# Altium schematic sheet Processor.SchDoc
size A4; SheetNumber: 2; SheetTotal: 5; SPICEModelCacheYJUROCZO: <root> / <DocumentId>YJUROCZO</DocumentId> / <CacheFrame Number="0"> / <Model Name="umk107bj105_a-t" Kind="CKT"> / <Text>* UMK107BJ105_A-T     SPICE MODEL  ( General Type ) / *-------------------------------------------------------------------------------------------------------- / * Model Generated by TAIYO YUDEN Corporation (http://www.ty-top.com) / * Version 1.0 / * TAIYO YUDEN Control No. 170508_130520 / * Copyright(c) 2012 TAIYO YUDEN CO.,LTD. All Rights Reserved. / *-------------------------------------------------------------------------------------------------------- / * / * Products Name : Multilayer Ceramic Capacitors / * / * Characteristics : / *     Capacitance : 1 uF , Rated Voltage : 50V , TCC : X5R / *     Case Size : 1.6 x 0.8 / 0.063 x 0.031 [mm/inch] , Thickness : 0.8 / 0.031 [mm/inch] / *     (Conditions: Temperature = 25 degC , DC Bias Current/Voltage = 0A / 0V) / * / * Frequency Range : 40Hz - 3GHz / * / * External Node Assignments : / * / *  1  o---| |---o  2 / * / *-------------------------------------------------------------------------------------------------------- / .SubCkt UMK107BJ105_A-T 1 2 / **************************** / C0 1 110 0.79929u / Cm 1 101 0.13681u / C1 101 102 0.26224u / Rc1 101 102 5.8806k / C2 102 103 0.057839u / Rc2 102 103 469.42 / C3 103 110 0.014568u / Rc3 103 110 14.853 / C2m 1 301 0.13283u / C21 301 302 1.2593u / Rc21 301 302 6.3079k / C22 302 303 1.1189u / Rc22 302 303 6.9405k / C23 303 304 1.1421u / Rc23 303 304 6.4848k / C24 304 305 0.36861u / Rc24 304 305 785 / C25 305 306 0.39327u / Rc25 305 306 637.41 / C26 306 307 0.27451u / Rc26 306 307 19.365 / C27 307 308 0.15295u / Rc27 307 308 23.239 / C28 308 309 0.17569u / Rc28 308 309 17.788 / C29 309 110 1420.6p / Rc29 309 110 1.9725 / Rp0 1 110 500Meg / L0 110 120 0.24088n / Lm 120 130 0.1369n / L1 120 121 0.1842n / RL1 121 130 0.29804 / L2 120 122 0.40657n / RL2 122 130 0.57395 / L3 120 123 0.85773n / RL3 123 130 0.82282 / CR 120 124 0.11463u / LR 124 125 0.25983n / RR 125 130 52.447m / CL 130 140 1.4637p / LL 130 140 0.23986n / RL 130 140 33.985 / Rs 140 2 6.8539m / **************************** / .ends UMK107BJ105_A-T</Text> / </Model> / </CacheFrame> / </root>
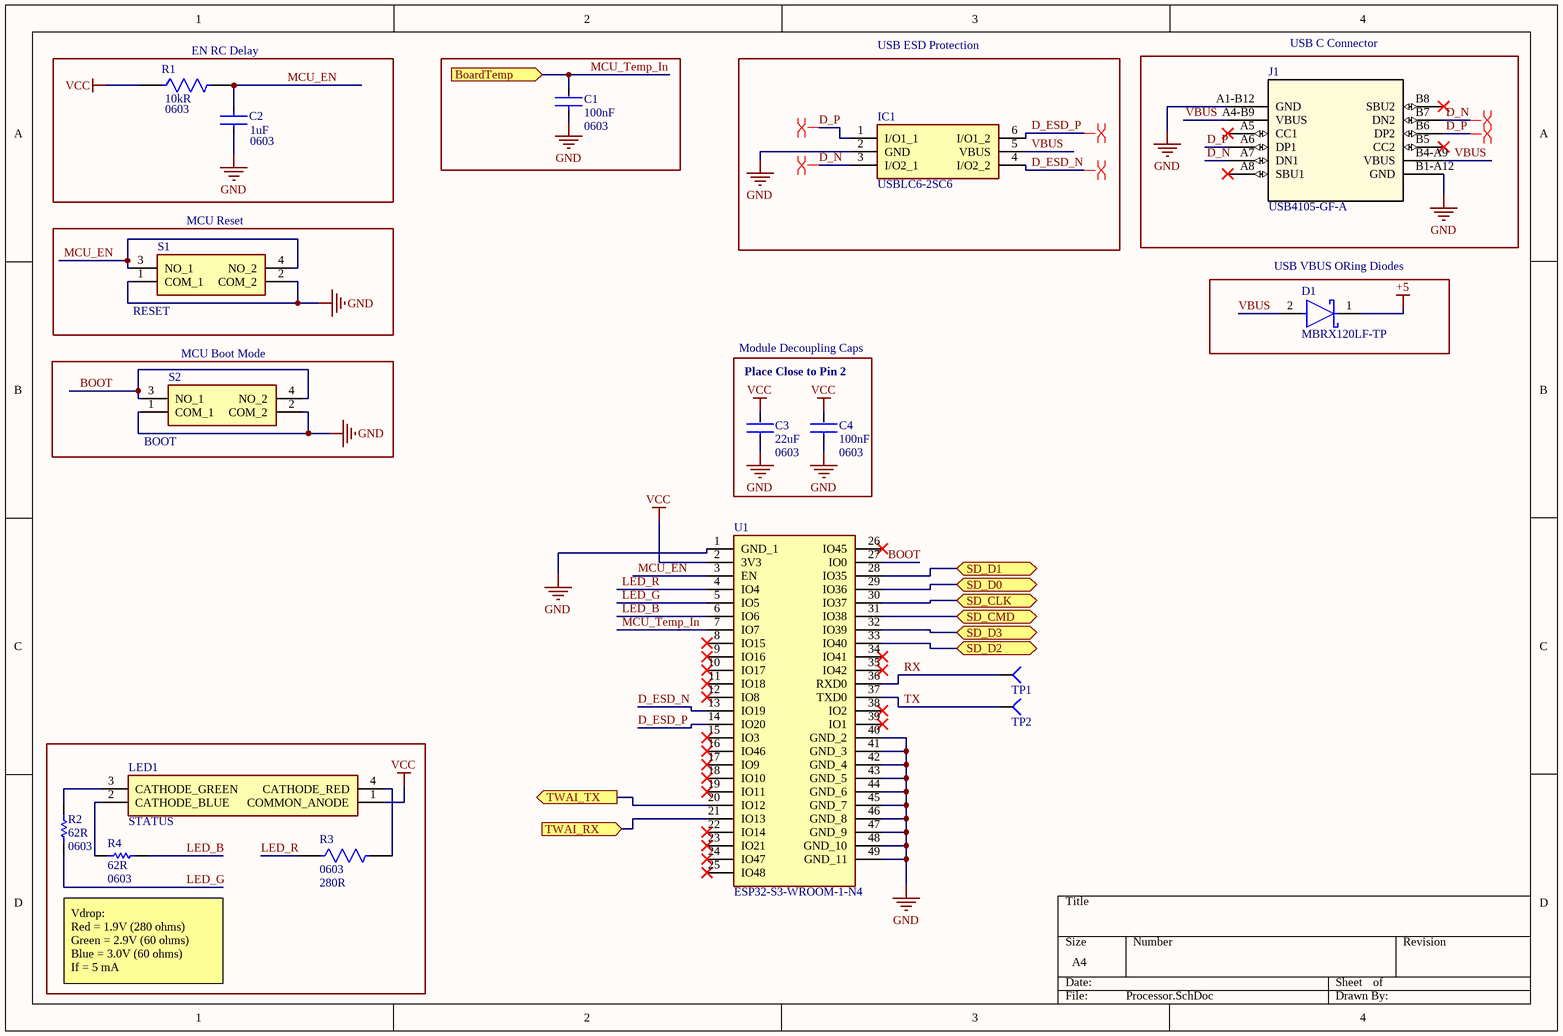
[diagram p0: Processor.SchDoc]

## Parts
C1  Capacitance: 100nF  Case/Package: 0603  [FP-CL10-IPC_A]  (hidden comment: CL10B104KB8WPNC)
C2  Case/Package: 0603  Capacitance: 1uF  [FP-0603-L_1_6_0_1-W_0_8_0-IPC_A]  (hidden comment: UMK107BJ105KA-T)
C3  Capacitance: 22uF  Case Code (Imperial): 0603  [FP-GRM188-0_2-IPC_C]  (hidden comment: GRM188R61A226ME15D)
C4  Capacitance: 100nF  Case/Package: 0603  [FP-CL10-IPC_A]  (hidden comment: CL10B104KB8WPNC)
D1  MBRX120LF-TP  [FP-SOD-123-IPC_A]
IC1  USBLC6-2SC6  [SOT95P280X145-6N]
J1  USB4105-GF-A  [USB4105_GCT]
LED1  STATUS  [CLMVCFKACL1D1L71BB7C3C3]
R1  Case Code (Imperial): 0603  Resistance: 10kR  [FP-RMCF0603-MFG]  (hidden comment: RMCF0603JG10K0)
R2  Resistance: 62R  Package: 0603  [RESC1608X55X30ML15T15]  (hidden comment: ERJ-3GEYJ620V)
R3  Case/Package: 0603  Resistance: 280R  [FP-RMCF0603-MFG]  (hidden comment: RMCF0603FT280R)
R4  Resistance: 62R  Package: 0603  [RESC1608X55X30ML15T15]  (hidden comment: ERJ-3GEYJ620V)
S1  RESET  [PTS526SKG15SMTR2LFS]
S2  BOOT  [PTS526SKG15SMTR2LFS]
TP1  RX  [TESTPOINT_CIRCLE_1MM]  (value not drawn)  (no BOM)
TP2  TX  [TESTPOINT_CIRCLE_1MM]  (value not drawn)  (no BOM)
U1  ESP32-S3-WROOM-1-N4  [ESP32S3WROOM1N4]

## Blocks framed on the sheet
EN RC Delay: C2 R1
USB ESD Protection: IC1
USB C Connector: J1
MCU Reset: S1
USB VBUS ORing Diodes: D1
MCU Boot Mode: S2

## Ports
BoardTemp (in), SD_CLK (bidir), SD_CMD (bidir), SD_D0 (bidir), SD_D1 (bidir), SD_D2 (bidir), SD_D3 (bidir), TWAI_RX (in), TWAI_TX (out)

## Nets
+5: D1.1(C)
GND: C1.1 C2.2 C3.1 C4.1 IC1.2(GND) J1.A1-B12(GND) J1.B1-A12(GND) S1.1(COM_1) S1.2(COM_2) S2.1(COM_1) S2.2(COM_2) U1.1(GND_1) U1.40(GND_2) U1.41(GND_3) U1.42(GND_4) U1.43(GND_5) U1.44(GND_6) U1.45(GND_7) U1.46(GND_8) U1.47(GND_9) U1.48(GND_10) U1.49(GND_11)
VCC: C3.2 C4.2 LED1.1(COMMON_ANODE) R1.1 U1.2(3V3)
BOOT: S2.3(NO_1) S2.4(NO_2) U1.27(IO0)
D_ESD_N: IC1.4(I/O2_2) U1.13(IO19)
D_ESD_P: IC1.6(I/O1_2) U1.14(IO20)
D_N: IC1.3(I/O2_1) J1.A7(DN1) J1.B7(DN2)
D_P: IC1.1(I/O1_1) J1.A6(DP1) J1.B6(DP2)
LED_B: R4.2 U1.6(IO6)
LED_G: R2.2 U1.5(IO5)
LED_R: R3.1 U1.4(IO4)
MCU_EN: C2.1 R1.2 S1.3(NO_1) S1.4(NO_2) U1.3(EN)
MCU_Temp_In: C1.2 U1.7(IO7) ; port BoardTemp
RX: TP1.1(=value) U1.36(RXD0)
SD_CLK: U1.30(IO37) ; port SD_CLK
SD_CMD: U1.31(IO38) ; port SD_CMD
SD_D0: U1.29(IO36) ; port SD_D0
SD_D1: U1.28(IO35) ; port SD_D1
SD_D2: U1.33(IO40) ; port SD_D2
SD_D3: U1.32(IO39) ; port SD_D3
TWAI_RX: U1.21(IO13) ; port TWAI_RX
TWAI_TX: U1.20(IO12) ; port TWAI_TX
TX: TP2.1(=value) U1.37(TXD0)
VBUS: D1.2(A) IC1.5(VBUS) J1.A4-B9(VBUS) J1.B4-A9(VBUS)
NetLED1_2: LED1.2(CATHODE_BLUE) R4.1
NetLED1_3: LED1.3(CATHODE_GREEN) R2.1
NetLED1_4: LED1.4(CATHODE_RED) R3.2

Not connected (* = marked no-connect by the designer): J1 A5(CC1)* A8(SBU1)* B5(CC2)* B8(SBU2)*; U1 8(IO15)* 9(IO16)* 10(IO17)* 11(IO18)* 12(IO8)* 15(IO3)* 16(IO46)* 17(IO9)* 18(IO10)* 19(IO11)* 22(IO14)* 23(IO21)* 24(IO47)* 25(IO48)* 26(IO45)* 34(IO41)* 35(IO42)* 38(IO2)* 39(IO1)*

## Layout directives
differential pair: D_ESD_N, D_ESD_P, D_N, D_P

## Notes on the sheet
- Module Decoupling Caps
- Place Close to Pin 2
- Vdrop:
  Red = 1.9V (280 ohms)
  Green = 2.9V (60 ohms)
  Blue = 3.0V (60 ohms)
  If = 5 mA

## Library data of the parts
C1 C4 = CMP-13271-002353-1: Cap Ceramic 100nF 50V X7R ±10% Pad SMD 0603 +125°C T/R; Ratings: AEC-Q200; Features: Soft Termination; Max Operating Temperature: 125°C; Mount: Surface Mount; Width: 0.031inch; Voltage Rating: 50V; Case Code (Metric): 1608; Case Code (Imperial): 0603; Tolerance: 10%; Min Operating Temperature: -55°C; Thickness: 0.035inch; Lead Free: Lead Free; Packaging: Tape and Reel; Length: 0.063inch
C2 = CMP-2000-05447-3: None; Tolerance: 10%; Voltage Rating: 50V; Dielectric: X5R; Height: 0.8mm; Depth: 0.8mm; Number of Pins: 2; Length: 1.6mm; Thickness: 0.035inch; Contact Plating: Nickel; Radiation Hardening: No; Package Quantity: 1; Halogen Free: Halogen Free; RoHS Compliant: Yes; Termination: SMD/SMT; Max Operating Temperature: 85°C; Min Operating Temperature: -55°C; Case Code (Metric): 1608; Construction: Flat; Voltage Rating (DC): 50V; Packaging: Tape and Reel; Series: M; Case Code (Imperial): 0603; Width: 0.031inch; Mount: Surface Mount
C3 = CMP-2000-06337-3: Chip Multilayer Ceramic Capacitors for General Purpose, 0603, 22uF, X5R, 15%, 20%, 10V; Tolerance: 20%; Weight: 0.000222oz; Material: Ceramic; Depth: 0.8mm; Length: 1.6mm; Termination: SMD/SMT; Packaging: Tape and Reel; Width: 0.8mm; Voltage Rating: 10V; Mount: Surface Mount; Voltage Rating (DC): 10V; Case/Package: 0603; Thickness: 0.039inch; REACH SVHC: No SVHC; Dielectric: X5R; Height: 0.8mm; Package Quantity: 4000; Case Code (Metric): 1608; Min Operating Temperature: -55°C; Lead Free: Lead Free; Max Operating Temperature: 85°C
D1 = CMP-56206-000012-1: DIODE SCHOTTKY 20V 1A SOD123; Max Power Dissipation: 556mW; Forward Voltage: 360mV; Peak Non-Repetitive Surge Current: 12A; Element Configuration: Single; Max Reverse Voltage (DC): 20V; Lead Free: Lead Free; Max Operating Temperature: 125°C; Radiation Hardening: No; Mount: Surface Mount; Number of Pins: 2; Average Rectified Current: 1A; Min Operating Temperature: -65°C; Max Repetitive Reverse Voltage (Vrrm): 20V; RoHS Compliant: Yes; Package Quantity: 1; Max Forward Surge Current (Ifsm): 12A; Packaging: Tape and Reel; Max Surge Current: 12A; Forward Current: 1A
IC1 = USBLC6-2SC6: Integrated Circuit; Manufacturer_Name: STMicroelectronics; Datasheet Link: http://www.st.com/st-web-ui/static/active/en/resource/technical/document/datasheet/CD00050750.pdf; Height: 1.45mm; Manufacturer_Part_Number: USBLC6-2SC6; Mouser Part Number: 511-USBLC6-2SC6; Mouser Price/Stock: https://www.mouser.co.uk/ProductDetail/STMicroelectronics/USBLC6-2SC6?qs=po45yt2pPpu%2FhNIlwQdTlg%3D%3D; Arrow Part Number: USBLC6-2SC6; Arrow Price/Stock: https://www.arrow.com/en/products/usblc6-2sc6/stmicroelectronics?region=nac
J1 = USB4105-GF-A: No Description Available; Mfr_Name: Global Connector Technology; Copyright: Copyright (C) 2022 Ultra Librarian. All rights reserved.; Manufacturer_Part_Number: USB4105-GF-A; Digi-Key_Part_Number_1: 2073-USB4105-GF-ACT-ND; Digi-Key_Part_Number_2: 2073-USB4105-GF-ADKR-ND; Digi-Key_Part_Number_3: 2073-USB4105-GF-ATR-ND; RefDes: RefDes; Type: DEV
LED1 = CLMVC-FKA-CL1D1L71BB7C3C3: LED; Manufacturer_Name: Wolfspeed; Datasheet Link: https://www.cree.com/led-components/media/documents/1273-CLMVC-FKA.pdf; Height: 1mm; Manufacturer_Part_Number: CLMVC-FKA-CL1D1L71BB7C3C3; Mouser Part Number: 941-CLMVCFKACL1D1L71; Mouser Price/Stock: https://www.mouser.co.uk/ProductDetail/Cree-LED/CLMVC-FKA-CL1D1L71BB7C3C3?qs=fSnNYG2PaKLJAXXrLOgMiQ%3D%3D; Arrow Part Number: CLMVC-FKA-CL1D1L71BB7C3C3; Arrow Price/Stock: https://www.arrow.com/en/products/clmvc-fka-cl1d1l71bb7c3c3/cree-led?region=nac
R1 = CMP-26527-000153-1: 10kΩ ±5% 0.1W 0603 Thick Film Chip Resistor AEC-Q200 compliant; Temperature Coefficient: 200ppm/°C; Max Power Dissipation: 100mW; Tolerance: 5%; Series: RMCF; Resistor Type: Thick Film; Length: 0.061inch; Features: Automotive AEC-Q200; Height: 0.022inch; Case Code (Metric): 1608; Width: 0.031inch; Number of Terminations: 2; Contact Plating: Tin; Case/Package: 0603; Package Quantity: 1; Max Operating Temperature: 155°C; Mount: Surface Mount; RoHS Compliant: Yes; Radiation Hardening: No; Min Operating Temperature: -55°C; Packaging: Tape and Reel
R2 R4 = CMP-1012-00045-2: Manufacturer: Panasonic; Part Number: ERJ-3GEYJ620V
R3 = CMP-26527-006784-1: 280Ω ±1% 0.1W 0603 Thick Film Chip Resistor AEC-Q200 compliant; Max Power Dissipation: 100mW; Temperature Coefficient: 100ppm/°C; RoHS Compliant: Yes; Height: 0.022inch; Resistor Type: Thick Film; Case Code (Metric): 1608; Radiation Hardening: No; Contact Plating: Tin; Series: RMCF; Features: Automotive AEC-Q200; Number of Terminations: 2; Tolerance: 1%; Packaging: Tape and Reel; Max Operating Temperature: 155°C; Min Operating Temperature: -55°C; Length: 0.061inch; Lead Free: Lead Free; Width: 0.031inch; Mount: Surface Mount; Case Code (Imperial): 0603
S1 S2 = PTS526_SK08_SMTR2_LFS: Switch; Manufacturer_Name: C & K COMPONENTS; Manufacturer_Part_Number: PTS526 SK08 SMTR2 LFS; Datasheet Link: https://www.ckswitches.com/media/2780/pts526.pdf; Height: 1.6mm; Mouser Part Number: 611-PTS526SK08SMTR2L; Mouser Price/Stock: https://www.mouser.co.uk/ProductDetail/CK/PTS526-SK08-SMTR2-LFS?qs=UXgszm6BlbECw%2FyKtIWLXA%3D%3D; Arrow Part Number: PTS526 SK08 SMTR2 LFS; Arrow Price/Stock: https://www.arrow.com/en/products/pts526-sk08-smtr2-lfs/ck?region=nac
TP1 TP2 = TESTPOINT_1MM_CIRCLE: TESTPOINT 1MM CIRCLE; Part Number (MPN): *
U1 = ESP32-S3-WROOM-1-N4: Integrated Circuit; Manufacturer_Name: Espressif Systems; Datasheet Link: https://www.espressif.com/sites/default/files/documentation/esp32-s3-wroom-1_wroom-1u_datasheet_en.pdf; Height: 3.25mm; Manufacturer_Part_Number: ESP32-S3-WROOM-1-N4; Mouser Part Number: 356-ESP32-S3WROOM1N4; Mouser Price/Stock: https://www.mouser.co.uk/ProductDetail/Espressif-Systems/ESP32-S3-WROOM-1-N4?qs=Li%252BoUPsLEnsO%2FkiJOUK0FQ%3D%3D